# Altium project motordriver-v5.1.PrjPcb (part 3 of 3)
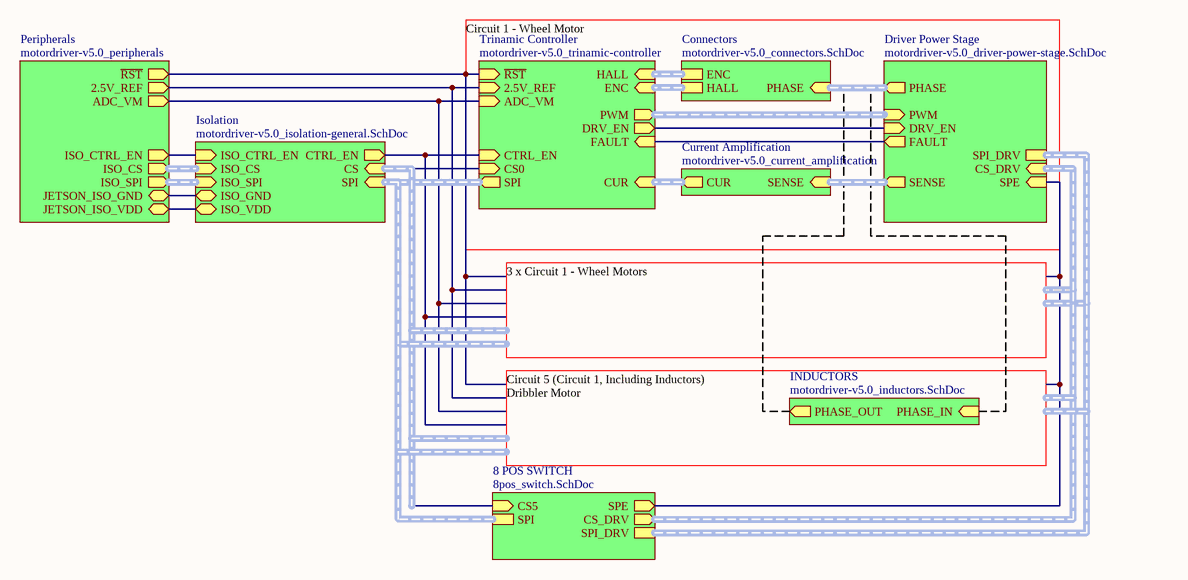
[diagram p14: top-level-simplified.SchDoc]

## Nets that join several sheets
5V: Peripherals (7 pins), motordriver-v5.0_trinamic-controller-dribbler (6 pins), motordriver-v5.0_connectors-dribbler (J7.5), Trinamic Controller 0 (6 pins), Connectors 0 (J4A.5), Current Amplification 0 (U7A.3 U8A.3), Trinamic Controller 1 (6 pins), Connectors 1 (J4B.5), Current Amplification 1 (U7B.3 U8B.3), Trinamic Controller 2 (6 pins), Connectors 2 (J4C.5), Current Amplification 2 (U7C.3 U8C.3), Trinamic Controller 3 (6 pins), Connectors 3 (J4D.5), Current Amplification 3 (U7D.3 U8D.3), Current Amplification 4 (U7E.3 U8E.3), Peripherals (7 pins), Trinamic Controller (6 pins), Connectors (J4E.5), Current Amplification (U7F.3 U8F.3)
GND: Peripherals (14 pins), motordriver-v5.0_trinamic-controller-dribbler (34 pins), motordriver-v5.0_connectors-dribbler (J7.4), Driver Power Stage 0 (5 pins), Trinamic Controller 0 (37 pins), Connectors 0 (J4A.4 J5A.4), Isolation 2 (C45A.1 R58A.2 U6A.9 U6A.15), Current Amplification 0 (8 pins), Driver Power Stage 1 (5 pins), Trinamic Controller 1 (37 pins), Connectors 1 (J4B.4 J5B.4), Current Amplification 1 (8 pins), Driver Power Stage 2 (5 pins), Trinamic Controller 2 (37 pins), Connectors 2 (J4C.4 J5C.4), Current Amplification 2 (8 pins), Driver Power Stage 3 (5 pins), Trinamic Controller 3 (37 pins), Connectors 3 (J4D.4 J5D.4), Current Amplification 3 (8 pins), Driver Power Stage 4 (5 pins), Current Amplification 4 (8 pins), motordriver-v5.1_demux_dribbler (U12.3 U12.4), U_motordriver-v5.1_demux (U11A.8), U_motordriver-v5.1_demux (U11B.8), Isolation 3 (C45B.1 R58B.2 U6B.9 U6B.15), Isolation 4 (C45C.1 R58C.2 U6C.9 U6C.15), Peripherals (14 pins), Driver Power Stage (5 pins), Trinamic Controller (37 pins), Connectors (J4E.4 J5E.4), Current Amplification (8 pins), Isolation (C45D.1 R58D.2 U6D.9 U6D.15)
PGND: Peripherals (7 pins), Driver Power Stage 0 (21 pins), Driver Power Stage 1 (21 pins), Driver Power Stage 2 (21 pins), Driver Power Stage 3 (21 pins), Driver Power Stage 4 (21 pins), Peripherals (7 pins), Driver Power Stage (21 pins)
VCC: Peripherals (7 pins), Driver Power Stage 0 (20 pins), Driver Power Stage 1 (20 pins), Driver Power Stage 2 (20 pins), Driver Power Stage 3 (20 pins), Driver Power Stage 4 (20 pins), Peripherals (7 pins), Driver Power Stage (20 pins)
VDD: Peripherals (5 pins), motordriver-v5.0_trinamic-controller-dribbler (17 pins), Driver Power Stage 0 (C43A.1 R18A.2 U5A.16), Trinamic Controller 0 (22 pins), Connectors 0 (J5A.3), Isolation 2 (C45A.2 U6A.16), Driver Power Stage 1 (C43B.1 R18B.2 U5B.16), Trinamic Controller 1 (22 pins), Connectors 1 (J5B.3), Driver Power Stage 2 (C43C.1 R18C.2 U5C.16), Trinamic Controller 2 (22 pins), Connectors 2 (J5C.3), Driver Power Stage 3 (C43D.1 R18D.2 U5D.16), Trinamic Controller 3 (22 pins), Connectors 3 (J5D.3), Driver Power Stage 4 (C43E.1 R18E.2 U5E.16), motordriver-v5.1_demux_dribbler (U12.8), U_motordriver-v5.1_demux (U11A.16), U_motordriver-v5.1_demux (U11B.16), Isolation 3 (C45B.2 U6B.16), Isolation 4 (C45C.2 U6C.16), Peripherals (5 pins), Driver Power Stage (C43F.1 R18F.2 U5F.16), Trinamic Controller (22 pins), Connectors (J5E.3), Isolation (C45D.2 U6D.16)
2.5V_REF: Peripherals (7 pins), motordriver-v5.0_trinamic-controller-dribbler (U9.17 U9.19 U9.50), Trinamic Controller 0 (U2A.17 U2A.19 U2A.50), Current Amplification 0 (6 pins), Trinamic Controller 1 (U2B.17 U2B.19 U2B.50), Current Amplification 1 (6 pins), Trinamic Controller 2 (U2C.17 U2C.19 U2C.50), Current Amplification 2 (6 pins), Trinamic Controller 3 (U2D.17 U2D.19 U2D.50), Current Amplification 3 (6 pins), Current Amplification 4 (6 pins)
2.5V_REF: Peripherals (C3B.2 R11B.2 R12B.1), Trinamic Controller (U2E.17 U2E.19)
ADC_VM: Peripherals (C16.2 R24.2 R25.1), motordriver-v5.0_trinamic-controller-dribbler (U9.20), Trinamic Controller 0 (U2A.20), Trinamic Controller 1 (U2B.20), Trinamic Controller 2 (U2C.20), Trinamic Controller 3 (U2D.20)
ADC_VM: Peripherals (C5B.2 R14B.2 R16B.1), Trinamic Controller (U2E.20)
BIT_0: Isolation 2 (U6A.14), motordriver-v5.1_demux_dribbler (U12.5), U_motordriver-v5.1_demux (U11A.2 U11A.14), U_motordriver-v5.1_demux (U11B.2 U11B.14)
BIT_1: U_motordriver-v5.1_demux (U11A.3 U11A.13), U_motordriver-v5.1_demux (U11B.3 U11B.13), Isolation 3 (U6B.14)
~{CS}0: Trinamic Controller 0 (U2A.6), U_motordriver-v5.1_demux (U11A.5)
~{CS}1: Trinamic Controller 1 (U2B.6), U_motordriver-v5.1_demux (U11A.11)
~{CS}2: Trinamic Controller 2 (U2C.6), U_motordriver-v5.1_demux (U11B.5)
~{CS}3: Trinamic Controller 3 (U2D.6), U_motordriver-v5.1_demux (U11B.11)
~{CS}4: motordriver-v5.0_trinamic-controller-dribbler (U9.6), motordriver-v5.1_demux_dribbler (U12.6)
~{CS_DEMUX_0}: U_motordriver-v5.1_demux (U11A.1), Isolation 4 (U6C.14)
~{CS_DEMUX_1}: U_motordriver-v5.1_demux (U11A.15), Isolation 4 (U6C.13)
~{CS_DEMUX_2}: U_motordriver-v5.1_demux (U11B.1), Isolation 4 (U6C.12)
~{CS_DEMUX_3}: U_motordriver-v5.1_demux (U11B.15), Isolation 3 (U6B.13)
~{CS_DEMUX_4}: motordriver-v5.1_demux_dribbler (U12.2), Isolation 3 (U6B.12)
~{CS_DRV}0: Driver Power Stage 0 (U5A.10), U_motordriver-v5.1_demux (U11A.4)
~{CS_DRV}1: Driver Power Stage 1 (U5B.10), U_motordriver-v5.1_demux (U11A.12)
~{CS_DRV}2: Driver Power Stage 2 (U5C.10), U_motordriver-v5.1_demux (U11B.4)
~{CS_DRV}3: Driver Power Stage 3 (U5D.10), U_motordriver-v5.1_demux (U11B.12)
~{CS_DRV}4: Driver Power Stage 4 (U5E.10), motordriver-v5.1_demux_dribbler (U12.7)
CTRL_EN: motordriver-v5.0_trinamic-controller-dribbler (U9.55), Trinamic Controller 0 (U2A.55), Trinamic Controller 1 (U2B.55), Trinamic Controller 2 (U2C.55), Trinamic Controller 3 (U2D.55)
CUR_U0: Trinamic Controller 0 (U2A.16), Current Amplification 0 (C46A.2 R59A.2 TP12A.1)
CUR_U1: Trinamic Controller 1 (U2B.16), Current Amplification 1 (C46B.2 R59B.2 TP12B.1)
CUR_U2: Trinamic Controller 2 (U2C.16), Current Amplification 2 (C46C.2 R59C.2 TP12C.1)
CUR_U3: Trinamic Controller 3 (U2D.16), Current Amplification 3 (C46D.2 R59D.2 TP12D.1)
CUR_U4: motordriver-v5.0_trinamic-controller-dribbler (U9.16), Current Amplification 4 (C46E.2 R59E.2 TP12E.1)
CUR_W0: Trinamic Controller 0 (U2A.18), Current Amplification 0 (C49A.2 R60A.2 TP14A.1)
CUR_W1: Trinamic Controller 1 (U2B.18), Current Amplification 1 (C49B.2 R60B.2 TP14B.1)
CUR_W2: Trinamic Controller 2 (U2C.18), Current Amplification 2 (C49C.2 R60C.2 TP14C.1)
CUR_W3: Trinamic Controller 3 (U2D.18), Current Amplification 3 (C49D.2 R60D.2 TP14D.1)
CUR_W4: motordriver-v5.0_trinamic-controller-dribbler (U9.18), Current Amplification 4 (C49E.2 R60E.2 TP14E.1)
DRV_EN: Driver Power Stage (U5F.24), Trinamic Controller (U2E.32)
DRV_EN_0: Driver Power Stage 0 (U5A.24), Trinamic Controller 0 (U2A.32)
DRV_EN_1: Driver Power Stage 1 (U5B.24), Trinamic Controller 1 (U2B.32)
DRV_EN_2: Driver Power Stage 2 (U5C.24), Trinamic Controller 2 (U2C.32)
DRV_EN_3: Driver Power Stage 3 (U5D.24), Trinamic Controller 3 (U2D.32)
DRV_EN_4: motordriver-v5.0_trinamic-controller-dribbler (U9.32), Driver Power Stage 4 (U5E.24)
ENC_A0: Trinamic Controller 0 (R32_E.2 R35_E.1), Connectors 0 (J5A.1)
ENC_A1: Trinamic Controller 1 (R32_D.2 R35_D.1), Connectors 1 (J5B.1)
ENC_A2: Trinamic Controller 2 (R32_C.2 R35_C.1), Connectors 2 (J5C.1)
ENC_A3: Trinamic Controller 3 (R32_B.2 R35_B.1), Connectors 3 (J5D.1)
ENC_B0: Trinamic Controller 0 (R33_E.2 R36_E.1), Connectors 0 (J5A.2)
ENC_B1: Trinamic Controller 1 (R33_D.2 R36_D.1), Connectors 1 (J5B.2)
ENC_B2: Trinamic Controller 2 (R33_C.2 R36_C.1), Connectors 2 (J5C.2)
ENC_B3: Trinamic Controller 3 (R33_B.2 R36_B.1), Connectors 3 (J5D.2)
ENC_N0: Trinamic Controller 0 (R34_E.2 R37_E.1), Connectors 0 (J5A.5)
ENC_N1: Trinamic Controller 1 (R34_D.2 R37_D.1), Connectors 1 (J5B.5)
ENC_N2: Trinamic Controller 2 (R34_C.2 R37_C.1), Connectors 2 (J5C.5)
ENC_N3: Trinamic Controller 3 (R34_B.2 R37_B.1), Connectors 3 (J5D.5)
FAULT: Driver Power Stage (R56F.1 U5F.23), Trinamic Controller (U2E.70)
FAULT0: Driver Power Stage 0 (R56A.1 U5A.23), Trinamic Controller 0 (U2A.70)
FAULT1: Driver Power Stage 1 (R56B.1 U5B.23), Trinamic Controller 1 (U2B.70)
FAULT2: Driver Power Stage 2 (R56C.1 U5C.23), Trinamic Controller 2 (U2C.70)
FAULT3: Driver Power Stage 3 (R56D.1 U5D.23), Trinamic Controller 3 (U2D.70)
FAULT4: motordriver-v5.0_trinamic-controller-dribbler (U9.70), Driver Power Stage 4 (R56E.1 U5E.23)
HALL_UX0: Trinamic Controller 0 (R26_E.2 R29_E.1), Connectors 0 (J4A.3)
HALL_UX1: Trinamic Controller 1 (R26_D.2 R29_D.1), Connectors 1 (J4B.3)
HALL_UX2: Trinamic Controller 2 (R26_C.2 R29_C.1), Connectors 2 (J4C.3)
HALL_UX3: Trinamic Controller 3 (R26_B.2 R29_B.1), Connectors 3 (J4D.3)
HALL_UX4: motordriver-v5.0_trinamic-controller-dribbler (R62.2 R65.1), motordriver-v5.0_connectors-dribbler (J7.3)
HALL_V0: Trinamic Controller 0 (R27_E.2 R30_E.1), Connectors 0 (J4A.2)
HALL_V1: Trinamic Controller 1 (R27_D.2 R30_D.1), Connectors 1 (J4B.2)
HALL_V2: Trinamic Controller 2 (R27_C.2 R30_C.1), Connectors 2 (J4C.2)
HALL_V3: Trinamic Controller 3 (R27_B.2 R30_B.1), Connectors 3 (J4D.2)
HALL_V4: motordriver-v5.0_trinamic-controller-dribbler (R63.2 R66.1), motordriver-v5.0_connectors-dribbler (J7.2)
HALL_WY0: Trinamic Controller 0 (R28_E.2 R31_E.1), Connectors 0 (J4A.1)
HALL_WY1: Trinamic Controller 1 (R28_D.2 R31_D.1), Connectors 1 (J4B.1)
HALL_WY2: Trinamic Controller 2 (R28_C.2 R31_C.1), Connectors 2 (J4C.1)
HALL_WY3: Trinamic Controller 3 (R28_B.2 R31_B.1), Connectors 3 (J4D.1)
HALL_WY4: motordriver-v5.0_trinamic-controller-dribbler (R64.2 R67.1), motordriver-v5.0_connectors-dribbler (J7.1)
~{ISO_CS}0: Peripherals (R?A#2.1), Isolation 4 (U6C.3)
~{ISO_CS}1: Peripherals (R?A#3.1), Isolation 4 (U6C.4)
~{ISO_CS}2: Peripherals (R?A#4.1), Isolation 4 (U6C.5)
~{ISO_CS}3: Peripherals (R?A#5.1), Isolation 3 (U6B.4)
~{ISO_CS}4: Peripherals (R?A#6.1), Isolation 3 (U6B.5)
IN1: Peripherals (R?A#1.1), Isolation 2 (U6A.3)
IN1: Peripherals (R?A#7.1), Isolation 3 (U6B.3)
ISO_GND: Peripherals (J1B.0 J1B.13), Isolation (C44D.1 R57D.2 U6D.2 U6D.8)
ISO_SPI_MISO0: Peripherals (R?A#9.1), Isolation 2 (U6A.6)
ISO_SPI_MOSI0: Peripherals (R?A#10.1), Isolation 2 (U6A.4)
ISO_SPI_SCK0: Peripherals (R?A#8.1), Isolation 2 (U6A.5)
ISO_VDD: Peripherals (J1B.14), Isolation (C44D.2 U6D.1)
JETSON_ISO_GND: Peripherals (J1A.0 J1A.13), Isolation 2 (C44A.1 R57A.2 U6A.2 U6A.8), Isolation 3 (C44B.1 R57B.2 U6B.2 U6B.8), Isolation 4 (C44C.1 R57C.2 U6C.2 U6C.8)
JETSON_ISO_VDD: Peripherals (J1A.14), Isolation 2 (C44A.2 U6A.1), Isolation 3 (C44B.2 U6B.1), Isolation 4 (C44C.2 U6C.1)
~{RST}: Peripherals (C4B.2 J1B.12 R13B.1 R15B.1), Trinamic Controller (U2E.50)
SPI_MISO0: motordriver-v5.0_trinamic-controller-dribbler (U9.7), Trinamic Controller 0 (U2A.9), Isolation 2 (U6A.11), Trinamic Controller 1 (U2B.9), Trinamic Controller 2 (U2C.9), Trinamic Controller 3 (U2D.9)
SPI_MISO_DRV0: Driver Power Stage 0 (U5A.13), Driver Power Stage 1 (U5B.13), Driver Power Stage 2 (U5C.13), Driver Power Stage 3 (U5D.13), Driver Power Stage 4 (U5E.13)
SPI_MOSI0: motordriver-v5.0_trinamic-controller-dribbler (U9.8), Trinamic Controller 0 (U2A.8), Isolation 2 (U6A.13), Trinamic Controller 1 (U2B.8), Trinamic Controller 2 (U2C.8), Trinamic Controller 3 (U2D.8)
SPI_MOSI_DRV0: Driver Power Stage 0 (U5A.12), Driver Power Stage 1 (U5B.12), Driver Power Stage 2 (U5C.12), Driver Power Stage 3 (U5D.12), Driver Power Stage 4 (U5E.12)
SPI_SCK0: motordriver-v5.0_trinamic-controller-dribbler (U9.9), Trinamic Controller 0 (U2A.7), Isolation 2 (U6A.12), Trinamic Controller 1 (U2B.7), Trinamic Controller 2 (U2C.7), Trinamic Controller 3 (U2D.7)
SPI_SCK_DRV0: Driver Power Stage 0 (U5A.11), Driver Power Stage 1 (U5B.11), Driver Power Stage 2 (U5C.11), Driver Power Stage 3 (U5D.11), Driver Power Stage 4 (U5E.11)
U: Driver Power Stage 0 (7 pins), Current Amplification 0 (U7A.4)
U: Driver Power Stage 1 (7 pins), Current Amplification 1 (U7B.4)
U: Driver Power Stage 2 (7 pins), Current Amplification 2 (U7C.4)
U: Driver Power Stage 3 (7 pins), Current Amplification 3 (U7D.4)
U: Driver Power Stage 4 (7 pins), Current Amplification 4 (U7E.4)
U0: Driver Power Stage 0 (D3A#2.2 R40A.1 TP6A.1), Connectors 0 (J3A.1), Current Amplification 0 (U7A.5)
U1: Driver Power Stage 1 (D3B#1.2 R40B.1 TP6B.1), Connectors 1 (J3B.1), Current Amplification 1 (U7B.5)
U2: Driver Power Stage 2 (D3C.2 R40C.1 TP6C.1), Connectors 2 (J3C.1), Current Amplification 2 (U7C.5)
U3: Driver Power Stage 3 (D3D.2 R40D.1 TP6D.1), Connectors 3 (J3D.1), Current Amplification 3 (U7D.5)
U4_IN: INDUCTORS (L1A.1), Driver Power Stage 4 (D3E.2 R40E.1 TP6E.1), Current Amplification 4 (U7E.5)
U4_OUT: INDUCTORS (L1A.2), motordriver-v5.0_connectors-dribbler (J6.1)
UH0: Driver Power Stage 0 (U5A.14), Trinamic Controller 0 (U2A.39)
UH1: Driver Power Stage 1 (U5B.14), Trinamic Controller 1 (U2B.39)
UH2: Driver Power Stage 2 (U5C.14), Trinamic Controller 2 (U2C.39)
UH3: Driver Power Stage 3 (U5D.14), Trinamic Controller 3 (U2D.39)
UH4: motordriver-v5.0_trinamic-controller-dribbler (U9.39), Driver Power Stage 4 (U5E.14)
UL0: Driver Power Stage 0 (U5A.15), Trinamic Controller 0 (U2A.40)
UL1: Driver Power Stage 1 (U5B.15), Trinamic Controller 1 (U2B.40)
UL2: Driver Power Stage 2 (U5C.15), Trinamic Controller 2 (U2C.40)
UL3: Driver Power Stage 3 (U5D.15), Trinamic Controller 3 (U2D.40)
UL4: motordriver-v5.0_trinamic-controller-dribbler (U9.40), Driver Power Stage 4 (U5E.15)
V0: Driver Power Stage 0 (D4A#2.2 R46A.1 TP8A.1), Connectors 0 (J3A.2)
V1: Driver Power Stage 1 (D4B#1.2 R46B.1 TP8B.1), Connectors 1 (J3B.2)
V2: Driver Power Stage 2 (D4C.2 R46C.1 TP8C.1), Connectors 2 (J3C.2)
V3: Driver Power Stage 3 (D4D.2 R46D.1 TP8D.1), Connectors 3 (J3D.2)
V4_IN: INDUCTORS (L2A.1), Driver Power Stage 4 (D4E.2 R46E.1 TP8E.1)
V4_OUT: INDUCTORS (L2A.2), motordriver-v5.0_connectors-dribbler (J6.2)
VH0: Driver Power Stage 0 (U5A.17), Trinamic Controller 0 (U2A.41)
VH1: Driver Power Stage 1 (U5B.17), Trinamic Controller 1 (U2B.41)
VH2: Driver Power Stage 2 (U5C.17), Trinamic Controller 2 (U2C.41)
VH3: Driver Power Stage 3 (U5D.17), Trinamic Controller 3 (U2D.41)
VH4: motordriver-v5.0_trinamic-controller-dribbler (U9.41), Driver Power Stage 4 (U5E.17)
VL0: Driver Power Stage 0 (U5A.18), Trinamic Controller 0 (U2A.42)
VL1: Driver Power Stage 1 (U5B.18), Trinamic Controller 1 (U2B.42)
VL2: Driver Power Stage 2 (U5C.18), Trinamic Controller 2 (U2C.42)
VL3: Driver Power Stage 3 (U5D.18), Trinamic Controller 3 (U2D.42)
VL4: motordriver-v5.0_trinamic-controller-dribbler (U9.42), Driver Power Stage 4 (U5E.18)
W: Driver Power Stage 0 (7 pins), Current Amplification 0 (U8A.4)
W: Driver Power Stage 1 (7 pins), Current Amplification 1 (U8B.4)
W: Driver Power Stage 2 (7 pins), Current Amplification 2 (U8C.4)
W: Driver Power Stage 3 (7 pins), Current Amplification 3 (U8D.4)
W: Driver Power Stage 4 (7 pins), Current Amplification 4 (U8E.4)
W0: Driver Power Stage 0 (D5A.2 R53A.1 TP10A.1), Connectors 0 (J3A.3), Current Amplification 0 (U8A.5)
W1: Driver Power Stage 1 (D5B.2 R53B.1 TP10B.1), Connectors 1 (J3B.3), Current Amplification 1 (U8B.5)
W2: Driver Power Stage 2 (D5C.2 R53C.1 TP10C.1), Connectors 2 (J3C.3), Current Amplification 2 (U8C.5)
W3: Driver Power Stage 3 (D5D.2 R53D.1 TP10D.1), Connectors 3 (J3D.3), Current Amplification 3 (U8D.5)
W4_IN: INDUCTORS (L3A.1), Driver Power Stage 4 (D5E.2 R53E.1 TP10E.1), Current Amplification 4 (U8E.5)
W4_OUT: INDUCTORS (L3A.2), motordriver-v5.0_connectors-dribbler (J6.3)
WH0: Driver Power Stage 0 (U5A.19), Trinamic Controller 0 (U2A.46)
WH1: Driver Power Stage 1 (U5B.19), Trinamic Controller 1 (U2B.46)
WH2: Driver Power Stage 2 (U5C.19), Trinamic Controller 2 (U2C.46)
WH3: Driver Power Stage 3 (U5D.19), Trinamic Controller 3 (U2D.46)
WH4: motordriver-v5.0_trinamic-controller-dribbler (U9.46), Driver Power Stage 4 (U5E.19)
WL0: Driver Power Stage 0 (U5A.20), Trinamic Controller 0 (U2A.47)
WL1: Driver Power Stage 1 (U5B.20), Trinamic Controller 1 (U2B.47)
WL2: Driver Power Stage 2 (U5C.20), Trinamic Controller 2 (U2C.47)
WL3: Driver Power Stage 3 (U5D.20), Trinamic Controller 3 (U2D.47)
WL4: motordriver-v5.0_trinamic-controller-dribbler (U9.47), Driver Power Stage 4 (U5E.20)